# EAGLE design MinieasySens-RS485_V12-Build020 (EAGLE 7.7.0)
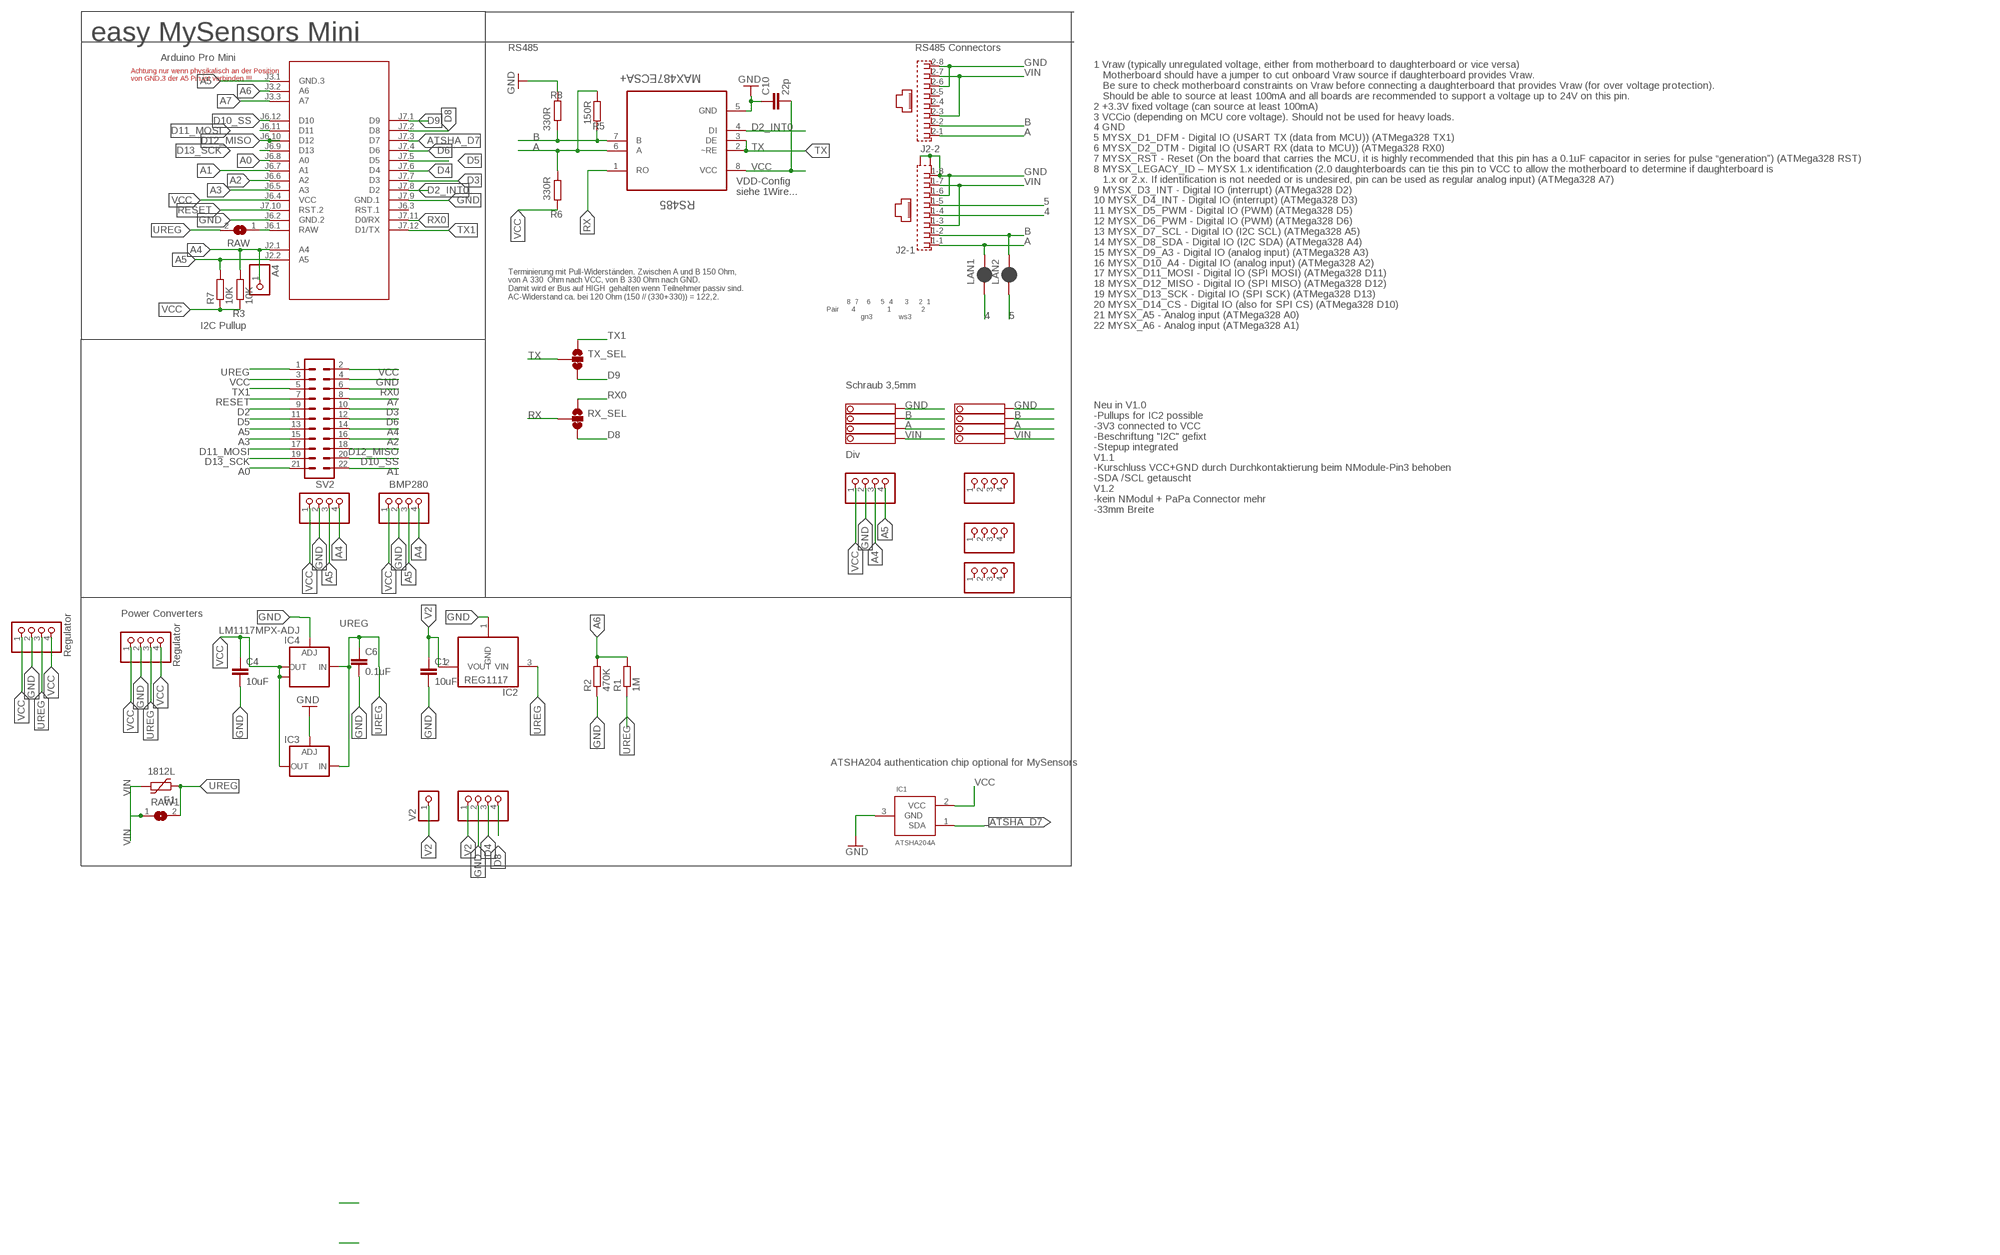
[diagram p0: schematic, sheet 1]

## Parts
A4  PINHD-1X1  [1X01]
BH1750  PINHD-1X04_2.54-S  [1X04-S]
C1  10uF  C-EUC1210  [C1210]
C4  10uF  C-EUC1210  [C1210]
C6  0.1uF  C-EUC1206  [C1206]
C10  22p  C-EUC0805  [C0805]
F1  1812L  [1812L]
I2C-1  PINHD-1X04_2.54-S  [1X04-S]
I2C-2  PINHD-1X04_2.54-S  [1X04-S]
IC1  ATSHA204A  [SOT23]
IC2  REG1117  [SOT223]
IC3  LD117ADT50TR  [DPACK]
IC4  LM1117MPX-ADJ  [SOT223]
J2  RJ45_2X_NARROW_SHILDPINS_NOCASE  [RJ45_2X_NARROW_SHILDPINS_NOCASE]
JP1  PINHD-1X04_2.54-S  [1X04-S]
JP2  PINHD-1X04_2.54-S  [1X04-S]
JP4  PINHD-1X04_2.54-S  [1X04-S]
LAN1  JUMPER-SMT_2_NC_PASTE_SILK  [SMT-JUMPER_2_NC_PASTE_SILK]
LAN2  JUMPER-SMT_2_NC_PASTE_SILK  [SMT-JUMPER_2_NC_PASTE_SILK]
M1  ARDUINO-PRO-MINI-3.3V#NP  [ARDUINO-PRO-MINI#NP]
R1  1M  R-EU_R0805  [R0805]
R2  470K  R-EU_R0805  [R0805]
R3  10K  R-EU_R0805  [R0805]
R5  150R  R-EU_R0805  [R0805]
R6  330R  R-EU_R0805  [R0805]
R7  10K  R-EU_R0805  [R0805]
R8  330R  R-EU_R0805  [R0805]
RAW  SJ  [SJ]
RAW1  SJ  [SJ]
RS485  MAX487ECSA+  [SOIC127P600X175-8N]
RX_SEL  JUMPER-SMT_3_1-NC_TRACE_SILK  [SMT-JUMPER_3_1-NC_TRACE_SILK]
STEPDWN  PINHD-1X04_2.54-S  [1X04-S]
STEPDWN1  PINHD-1X04_2.54-S  [1X04-S]
SV2  MA11-2  [MA11-2]
TX_SEL  JUMPER-SMT_3_1-NC_TRACE_SILK  [SMT-JUMPER_3_1-NC_TRACE_SILK]
V2  PINHD-1X1  [1X01]
V2-  PINHD-1X04_2.54-S  [1X04-S]
X1  1751264  [1751264]
X4  1751264  [1751264]

## Nets
4: J2.1-4 LAN1.1
5: J2.1-5 LAN2.1
A: J2.1-1 J2.2-1 LAN1.2 R5.1 R6.2 RS485.6(A) X1.2 X4.2
A0: M1.J6.8(A0) SV2.21
A1: M1.J6.7(A1) SV2.22
A2: M1.J6.6(A2) SV2.16
A3: M1.J6.5(A3) SV2.15
A4: A4.1 BH1750.4 I2C-1.4 I2C-2.3 M1.J2.1(A4) R3.2 SV2.14
A5: BH1750.3 I2C-1.3 I2C-2.4 M1.J2.2(A5) M1.J3.1(GND.3) R7.2 SV2.13
A6: M1.J3.2(A6) R1.2 R2.2
A7: M1.J3.3(A7) SV2.8
ATSHA_D7: IC1.1(SDA) M1.J7.3(D7)
B: J2.1-2 J2.2-2 LAN2.2 R5.2 R8.1 RS485.7(B) X1.3 X4.3
D2: SV2.9
D2_INT0: M1.J7.8(D2) RS485.4(DI)
D3: M1.J7.7(D3) SV2.10
D4: M1.J7.6(D4) V2-.3
D5: M1.J7.5(D5) SV2.11
D6: M1.J7.4(D6) SV2.12
D8: M1.J7.2(D8) RX_SEL.3 V2-.4
D9: M1.J7.1(D9) TX_SEL.3
D10_SS: M1.J6.12(D10) SV2.20
D11_MOSI: M1.J6.11(D11) SV2.17
D12_MISO: M1.J6.10(D12) SV2.18
D13_SCK: M1.J6.9(D13) SV2.19
GND [PWR]: BH1750.2 C1.2 C4.2 C6.2 C10.1 I2C-1.2 I2C-2.2 IC1.3(GND) IC2.1(GND) IC3.1(ADJ) IC4.1(ADJ) J2.1-6 J2.1-8 J2.2-6 J2.2-8 J2.G1(-1:S1) J2.G3(-1:S2) M1.J6.2(GND.2) M1.J7.9(GND.1) R2.1 R8.2 RS485.5(GND) STEPDWN1.2 STEPDWN.2 SV2.4 V2-.2 X1.4 X4.4
RAW [PWR]: M1.J6.1(RAW) RAW.1
RESET: M1.J7.10(RST.2) SV2.7
RX: RS485.1(RO) RX_SEL.2
RX0: M1.J7.11(D0/RX) RX_SEL.1 SV2.6
TX: RS485.2(~RE) RS485.3(DE) TX_SEL.2
TX1: M1.J7.12(D1/TX) SV2.5 TX_SEL.1
UREG [PWR]: C6.1 F1.P$1 IC2.3(VIN) IC3.3(IN) IC4.3(IN) R1.1 RAW1.2 RAW.2 STEPDWN1.3 STEPDWN.3 SV2.1
V2 [PWR]: C1.1 IC2.2(VOUT) V2-.1 V2.1
VCC [PWR]: BH1750.1 C4.1 C10.2 I2C-1.1 I2C-2.1 IC1.2(VCC) IC3.4(OUT) IC4.2(OUT) IC4.TAB(OUT1) M1.J6.4(VCC) R3.1 R6.1 R7.1 RS485.8(VCC) STEPDWN1.1 STEPDWN1.4 STEPDWN.1 STEPDWN.4 SV2.2 SV2.3
VIN [PWR]: F1.P$2 J2.1-3 J2.1-7 J2.2-3 J2.2-7 RAW1.1 X1.1 X4.1
Unconnected: J2.2-4 J2.2-5 JP1.1 JP1.2 JP1.3 JP1.4 JP2.1 JP2.2 JP2.3 JP2.4 JP4.1 JP4.2 JP4.3 JP4.4 M1.J6.3(RST.1)

## Notes on the sheet
- easy MySensors Mini
- RS485 | RS485 Connectors
- Arduino Pro Mini
- Achtung nur wenn physikalisch an der Position 
  von GND.3 der A5 Pin ist verbinden !!!
- VDD-Config
  siehe 1Wire...
- Terminierung mit Pull-Widerständen. Zwischen A und B 150 Ohm,
  von A 330  Ohm nach VCC, von B 330 Ohm nach GND. 
  Damit wird er Bus auf HIGH  gehalten wenn Teilnehmer passiv sind.
  AC-Widerstand ca. bei 120 Ohm (150 // (330+330)) = 122,2.
- 8  7    6     5  4      3     2  1
  Pair      4                1               2
                   gn3             ws3
- I2C Pullup
- 1 Vraw (typically unregulated voltage, either from motherboard to daughterboard or vice versa)
     Motherboard should have a jumper to cut onboard Vraw source if daughterboard provides Vraw. 
     Be sure to check motherboard constraints on Vraw before connecting a daughterboard that provides Vraw (for over voltage protection). 
     Should be able to source at least 100mA and all boards are recommended to support a voltage up to 24V on this pin.
  2 +3.3V fixed voltage (can source at least 100mA)
  3 VCCio (depending on MCU core voltage). Should not be used for heavy loads.
  4 GND
  5 MYSX_D1_DFM - Digital IO (USART TX (data from MCU)) (ATMega328 TX1)
  6 MYSX_D2_DTM - Digital IO (USART RX (data to MCU)) (ATMega328 RX0)
  7 MYSX_RST - Reset (On the board that carries the MCU, it is highly recommended that this pin has a 0.1uF capacitor in series for pulse “generation”) (ATMega328 RST)
  8 MYSX_LEGACY_ID – MYSX 1.x identification (2.0 daughterboards can tie this pin to VCC to allow the motherboard to determine if daughterboard is 
     1.x or 2.x. If identification is not needed or is undesired, pin can be used as regular analog input) (ATMega328 A7)
  9 MYSX_D3_INT - Digital IO (interrupt) (ATMega328 D2)
  10 MYSX_D4_INT - Digital IO (interrupt) (ATMega328 D3)
  11 MYSX_D5_PWM - Digital IO (PWM) (ATMega328 D5)
  12 MYSX_D6_PWM - Digital IO (PWM) (ATMega328 D6)
  13 MYSX_D7_SCL - Digital IO (I2C SCL) (ATMega328 A5)
  14 MYSX_D8_SDA - Digital IO (I2C SDA) (ATMega328 A4)
  15 MYSX_D9_A3 - Digital IO (analog input) (ATMega328 A3)
  16 MYSX_D10_A4 - Digital IO (analog input) (ATMega328 A2)
  17 MYSX_D11_MOSI - Digital IO (SPI MOSI) (ATMega328 D11)
  18 MYSX_D12_MISO - Digital IO (SPI MISO) (ATMega328 D12)
  19 MYSX_D13_SCK - Digital IO (SPI SCK) (ATMega328 D13)
  20 MYSX_D14_CS - Digital IO (also for SPI CS) (ATMega328 D10)
  21 MYSX_A5 - Analog input (ATMega328 A0)
  22 MYSX_A6 - Analog input (ATMega328 A1)
- Schraub 3,5mm
- Div
- BMP280
- Neu in V1.0
  -Pullups for IC2 possible
  -3V3 connected to VCC
  -Beschriftung "I2C" gefixt
  -Stepup integrated
  V1.1
  -Kurschluss VCC+GND durch Durchkontaktierung beim NModule-Pin3 behoben
  -SDA /SCL getauscht
  V1.2
  -kein NModul + PaPa Connector mehr
  -33mm Breite
- Power Converters
- Regulator
- Regulator
- ATSHA204 authentication chip optional for MySensors

## Library data of the parts
A4 V2 = pinhead:PINHD-1X1: PIN HEADER
BH1750 I2C-1 I2C-2 JP1 JP2 JP4 STEPDWN STEPDWN1 V2- = pinhead-2:PINHD-1X04: PIN HEADER
C1 C4 C6 C10 = rcl:C-EU: CAPACITOR, European symbol
F1 = ptc-littlefuse:1812L
IC1 = Sensor:ATSHA204A
IC2 = burr-brown:REG1117: 800mA and 1A Low Dropout (LDO) Positive Regulator 1.8V, 2.5V, 2.85V, 3.3V, 5V, and Adj; MPN: REG1117; OC_FARNELL: 1097566; OC_NEWARK: 14P6981
IC3 = v-reg:LD117A?*: Low drop fixed and adjustable positive voltage regulators 1 A Source: http://www.st.com/stonline/products/literature/ds/7194/ld1117axx.pdf
IC4 = lm1117:LM1117MPX-ADJ
J2 = RJ45:RJ45_2X_NARROW_SHILDPINS_NOCASE: RJ45 connector
LAN1 LAN2 = SparkFun-Jumpers:JUMPER-SMT_2_NC_PASTE: Normally closed solder jumper This jumper has an aperture in the stencil to allow solder paste to bridge the split in the wire so it's normally closed (NC). Wick off the solder to open the connection. Reapply solder to reclose the connection.
M1 = diy-modules:ARDUINO-PRO-MINI-*#NP: Arduino Pro Mini without programming pads
R1-R3 R5-R8 = rcl:R-EU_: RESISTOR, European symbol
RAW RAW1 = jumper:SJ: SMD solder JUMPER
RS485 = Maxim_By_element14_Batch_1:MAX487ECSA+: Low-Power, Slew-Rate-Limited RS-485/RS-422 Transceivers; MPN: MAX487ECSA+; OC_FARNELL: 9724532; OC_NEWARK: 68K4803; PACKAGE: SOIC-8; SUPPLIER: Maxim
RX_SEL TX_SEL = SparkFun-Jumpers:JUMPER-SMT_3_1-NC_TRACE: Normally closed trace jumper (1 of 2 connections) This jumper has a trace between two pads so it's normally closed (NC). The other connection is normally open (NO). Use a razor knife to open the connection. For best results follow the IPC guidelines for cutting traces: Cutout at least 0.063 mm (0.005 in). Remove all loose material to clean up the cut area. Seal the cut with an approved epoxy. Reapply solder to reclose the connection, or to close the NO connection.
SV2 = con-Pinheader:MA11-2: PIN HEADER; OC_FARNELL: unknown; OC_NEWARK: unknown
X1 X4 = con-phoenix-350:1751264: MKDS 1/ 4-3,5 Printklemme Nennstrom: 10 A Bemessungsspannung: 160 V Raster: 3,5 mm Polzahl: 4 Montageart: Löten Anschlussart: Schraubanschluss Anschlussrichtung vom Leiter zur Platine: 0° Source: http://eshop.phoenixcontact.com .. 1751264.pdf; MPN: 1751264; OC_FARNELL: unknown; OC_NEWARK: 10R0934

## Net classes
0 default: width 0.254 mm, clearance 0.205 mm
1 PWR: width 0.406 mm, clearance 0.205 mm to class 0, clearance 0.205 mm

## Board
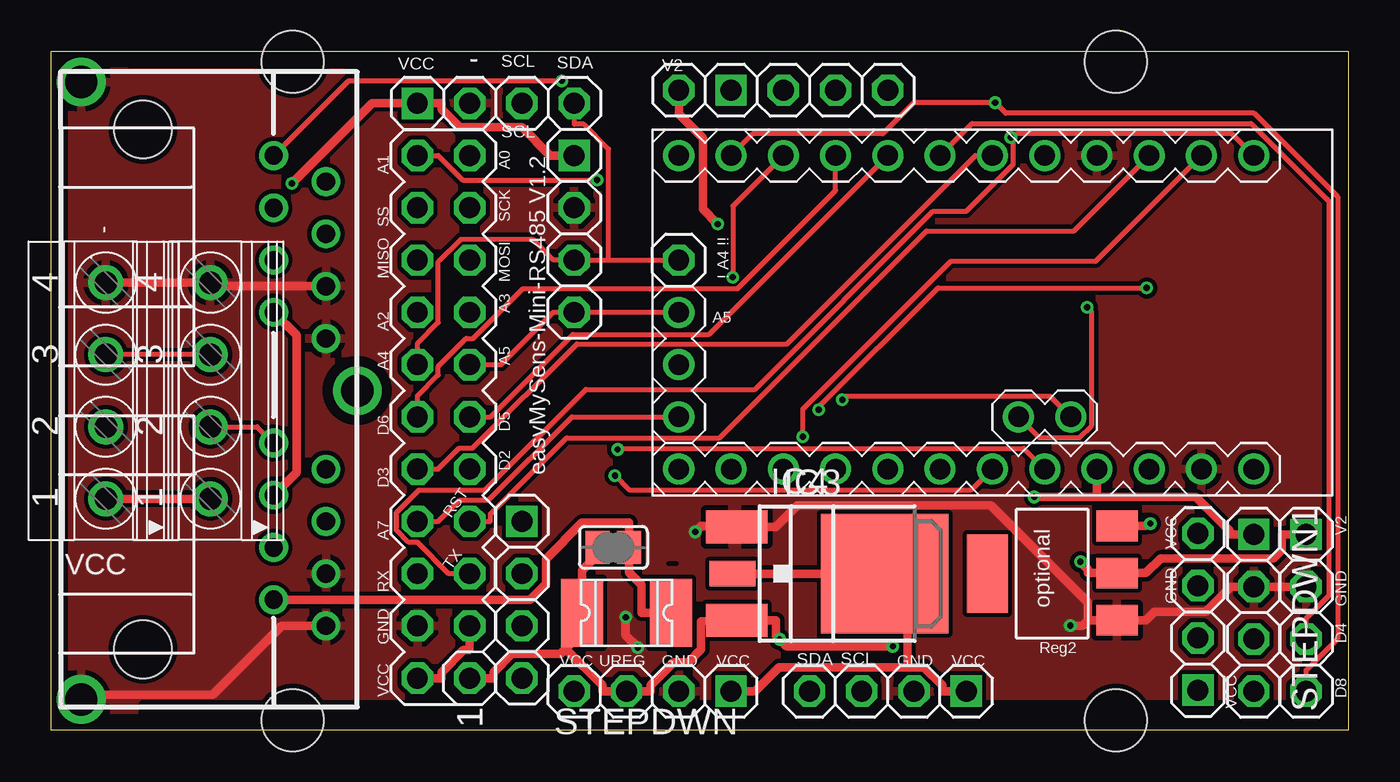
[diagram p1: board, top side]
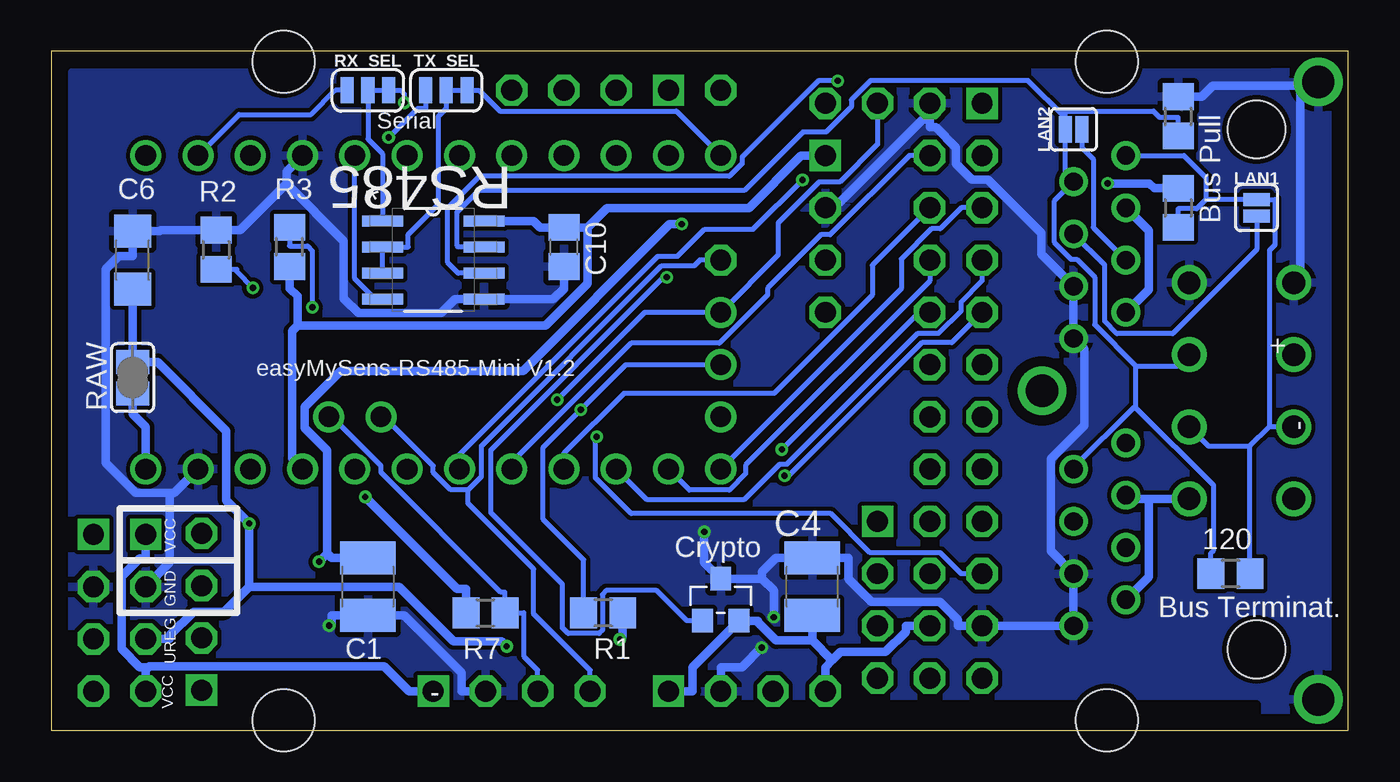
[diagram p2: board, bottom side, seen from below]

Size 63 x 33 mm. Coordinates in mm from the lower left corner, seen from the top.
Outline: 63,0 0,0 0,33 63,33 63,0
Copper layers (1*16): Top 0.035mm / dielectric 1.5mm / Bottom 0.035mm
Design rules "dirt_cheap_dirty_boards.v1": minimum track width 5mil, minimum drill 12mil, track to track 5mil, track to pad 5mil, pad to pad 5mil, via to via 5mil, smd to smd 0mil, copper to edge 10mil, drill to drill 10mil, minimum pad ring 10mil, minimum via ring 6mil, stop-mask expansion 2mil, vias tented up to drill 25mil, thermal gap 10mil
Holes 3 mm at 11.72,32.5 11.72,0.5 51.72,32.5 51.72,0.5
tRestrict: area 3.8,32.4 to 62.9,33; area 4.4,0 to 62.9,1.3; area 13.3,14.9 to 16.5,18.1; 2 lines
bRestrict: area 3.8,32.4 to 62.9,33; area 4.4,0 to 62.9,1.3; area 13.3,14.9 to 16.5,18.1; 2 lines

### Footprints (pad centres in the part's own frame; a part is rotated, then mirrored left to right if it is on the bottom)
1X01 = drill 1.016 octagon: 1 0,0
1X04-S = drill 1.016 square: 1 -3.81,0 | drill 1.016 octagon: 2 -1.27,0; 3 1.27,0; 4 3.81,0
C1210 = smd 1.6 x 2.7: 1 -1.4,0; 2 1.4,0
C1206 = smd 1.6 x 1.8: 1 -1.4,0; 2 1.4,0
C0805 = smd 1.3 x 1.5: 1 -0.95,0; 2 0.95,0
1812L = smd 2.03 x 3.3: P$1 -2.16,0; P$2 2.16,0
SOT23 = smd 1.016 x 1.143: 1 -0.889,-1.016; 2 0.889,-1.016; 3 0,1.016
SOT223 = smd 1.499 x 2.007: 1 -2.261,-3.15; 2 0.025,-3.15; 3 2.311,-3.15 | smd 3.81 x 2.007: 4 0,3.15
DPACK = smd 1.6 x 3: 1 -2.28,-4.8; 3 2.28,-4.8 | smd 5.8 x 6.2: 4 0,2.38
SOT223' = smd 1.219 x 2.235: 1 -2.311,-3.099; 2 0,-3.099; 3 2.311,-3.099 | smd 3.6 x 2.2: TAB 0,3.099
RJ45_2X_NARROW_SHILDPINS_NOCASE = drill 0.889: 1-1 -11.43,6.35; 1-2 -10.16,8.89; 1-3 -8.89,6.35; 1-4 -7.62,8.89; 1-5 -6.35,6.35; 1-6 -5.08,8.89; 1-7 -3.81,6.35; 1-8 -2.54,8.89; 2-1 2.54,6.35; 2-2 3.81,8.89; 2-3 5.08,6.35; 2-4 6.35,8.89; 2-5 7.62,6.35; 2-6 8.89,8.89; 2-7 10.16,6.35; 2-8 11.43,8.89 | drill 1.575 pad 2.184: G1 -15,-3; G2 0,10.414; G3 15,-3 | hole 2.8: -12.7,0; 12.573,0
SMT-JUMPER_2_NC_PASTE_SILK = smd 0.635 x 1.27: 1 -0.406,0; 2 0.406,0
ARDUINO-PRO-MINI#NP = drill 1: J2.1 -1.27,5.08; J2.2 -3.81,5.08; J3.1 15.24,0; J3.2 15.24,2.54; J3.3 15.24,5.08; J6.1 -12.7,7.62; J6.2 -10.16,7.62; J6.3 -7.62,7.62; J6.4 -5.08,7.62; J6.5 -2.54,7.62; J6.6 0,7.62; J6.7 2.54,7.62; J6.8 5.08,7.62; J6.9 7.62,7.62; J6.10 10.16,7.62; J6.11 12.7,7.62; J6.12 15.24,7.62; J7.1 15.24,-7.62; J7.2 12.7,-7.62; J7.3 10.16,-7.62; J7.4 7.62,-7.62; J7.5 5.08,-7.62; J7.6 2.54,-7.62; J7.7 0,-7.62; J7.8 -2.54,-7.62; J7.9 -5.08,-7.62; J7.10 -7.62,-7.62; J7.11 -10.16,-7.62; J7.12 -12.7,-7.62
R0805 = smd 1.3 x 1.5: 1 -0.95,0; 2 0.95,0
SJ = smd 1.168 x 1.6: 1 -0.762,0; 2 0.762,0
SOIC127P600X175-8N = smd 1.981 x 0.533: 1 -2.464,1.905; 2 -2.464,0.635; 3 -2.464,-0.635; 4 -2.464,-1.905; 5 2.464,-1.905; 6 2.464,-0.635; 7 2.464,0.635; 8 2.464,1.905
SMT-JUMPER_3_1-NC_TRACE_SILK = smd 0.635 x 1.27: 1 -1.016,0; 2 0,0; 3 1.016,0
MA11-2 = drill 1.016 octagon: 1 -12.7,-1.27; 2 -12.7,1.27; 3 -10.16,-1.27; 4 -10.16,1.27; 5 -7.62,-1.27; 6 -7.62,1.27; 7 -5.08,-1.27; 8 -5.08,1.27; 9 -2.54,-1.27; 10 -2.54,1.27; 11 0,-1.27; 12 0,1.27; 13 2.54,-1.27; 14 2.54,1.27; 15 5.08,-1.27; 16 5.08,1.27; 17 7.62,-1.27; 18 7.62,1.27; 19 10.16,-1.27; 20 10.16,1.27; 21 12.7,-1.27; 22 12.7,1.27
1751264 = drill 1.1 pad 1.7: 1 -5.25,-0.1; 2 -1.75,-0.1; 3 1.75,-0.1; 4 5.25,-0.1

### Placement (x,y rotation side)
A4  30.48,22.86 90 top
BH1750  21.59,30.48 0 top
C1  47.62,6.99 270 bottom
C4  26.04,6.99 90 bottom
C6  59.05,22.86 90 bottom
C10  38.1,23.5 90 bottom
F1  27.94,5.71 0 top
I2C-1  40.64,1.91 180 top
I2C-2  25.4,24.13 270 top
IC1  30.48,6.35 0 bottom
IC2  48.62,7.62 90 top
IC3  38.1,7.62 270 top
IC4  LM1117MPX-ADJ  [SOT223']  36.2,7.62 270 top
J2  4.45,16.51 270 top
JP1  22.86,6.35 270 top
JP2  36.83,31.11 0 top
JP4  55.7,5.76 90 top
LAN1  4.45,25.4 90 bottom
LAN2  13.34,29.21 180 bottom
M1  45.72,20.32 180 top
R1  36.2,5.71 180 bottom
R2  55,23.36 270 bottom
R3  51.44,23.5 90 bottom
R5  5.71,7.62 180 bottom
R6  8.26,25.4 270 bottom
R7  41.91,5.71 0 bottom
R8  8.26,29.84 90 bottom
RAW  59.05,17.14 90 bottom
RAW1  27.3,8.89 180 top
RS485  44.45,22.86 0 bottom
RX_SEL  47.62,31.11 0 bottom
STEPDWN  29.21,1.91 180 top
STEPDWN1  58.42,5.71 270 top
SV2  19.05,15.24 90 top
TX_SEL  43.81,31.11 0 bottom
V2  30.48,31.11 0 top
V2-  60.96,5.71 270 top
X1  2.54,16.51 90 top
X4  7.62,16.51 90 top

### Tracks (layer width: path | path; a pad name or v marks a point on that pad's centre or on a via)
4
  Bottom 0.254: LAN1.1 4.45,23.36 8.52,19.29 11.22,19.29 11.83,19.89 11.83,22.62 J2.1-4
5
  Bottom 0.254: LAN2.1 12.93,28.32 12.38,27.77 12.38,24.45 J2.1-5
A  (via drill 0.3 pad 0.61)
  Top 0.254: J2.1-1 14.43,31.57 v24.8,31.57 | X4.2 10.01,14.76 J2.2-1
  Bottom 0.254: RS485.6 43.23,22.23 43.77,22.76 43.77,25.36 42.2,26.93 | v24.8,31.57 25.74,31.57 29.45,27.87 29.45,27.54 30.06,26.93 42.2,26.93 | 42.2,26.93 | 3.83,14.76 3.83,23.33 3.56,23.59 3.56,25.81 LAN1.2 6.9,25.81 | 6.9,25.81 7.35,25.35 8.26,25.35 R6.2 | J2.1-1 7.97,27.94 6.9,26.87 6.9,25.81 | R5.1 4.76,13.82 | X4.2 6.79,13.82 4.76,13.82 | X1.2 3.83,14.76 | 3.83,14.76 4.76,13.82
A0
  Bottom 0.254: M1.J6.8 40.64,13.02 34.83,18.83 30.54,18.83 28.21,21.16 28.21,21.49 25.61,24.09 25.16,24.09 21.34,27.92 21.34,27.94 SV2.21
A1  (via drill 0.3 pad 0.61)
  Top 0.254: SV2.22 18.8,27.94 19.98,26.75 v26.51,26.75
  Bottom 0.254: M1.J6.7 43.18,13.41 33.54,23.05 32.57,23.05 31.26,24.36 28.91,24.36 v26.51,26.75
A2  (via drill 0.3 pad 0.61)
  Top 0.254: v27.38,12.38 28.07,11.69 44.71,11.69 M1.J6.6
  Bottom 0.254: SV2.16 19.25,18.84 20.7,18.84 27.17,12.38 v27.38,12.38
A3  (via drill 0.3 pad 0.61)
  Top 0.254: v27.51,13.66 27.56,13.71 47.25,13.71 M1.J6.5
  Bottom 0.254: SV2.15 20.84,20.32 v27.51,13.66
A4  (via drill 0.3 pad 0.61)
  Top 0.254: M1.J2.1 48,14.23 49.95,14.23 50.54,14.82 50.54,20.34 v50.32,20.56 | 27.07,22.86 A4.1 | 27.07,22.86 I2C-2.3 24.38,22.86 23.37,23.88 19.89,23.88 18.8,22.78 18.8,19.81 17.78,18.8 SV2.14 | 27.07,22.86 27.07,28.26 25.87,29.46 25.4,29.46 BH1750.4
  Bottom 0.254: 42.76,11.69 42.11,12.34 42.11,13.83 33.35,22.59 31.77,22.59 31.5,22.86 A4.1 | v50.32,20.56 50.32,23.31 50.56,23.54 51.44,23.54 R3.2 | 42.76,11.69 42.76,11.04 39.57,7.85 39.57,5.66 36.83,2.92 I2C-1.4 | 42.76,11.69 43.6,11.69 44.45,12.54 44.45,12.86 46.83,15.24 M1.J2.1
A5  (via drill 0.3 pad 0.61)
  Top 0.254: v38.43,16.07 38.61,16.25 48.52,16.25 M1.J2.2 | SV2.13 21.84,17.78 24.38,20.32 I2C-2.4 M1.J3.1
  Bottom 0.254: I2C-1.3 39.37,2.92 40.06,3.61 40.06,5.71 R7.2 40.96,6.72 41.17,6.72 46.99,12.54 46.99,12.86 49.37,15.24 M1.J2.2 | v38.43,16.07 34.18,20.32 M1.J3.1 27.69,23.11 27.69,24.66 25.7,26.65 24.69,26.65 22.86,28.48 BH1750.3
A6  (via drill 0.3 pad 0.61)
  Top 0.254: v37.27,15.59 | v37.27,15.59 37.27,15.71 43.08,21.51 v53.21,21.51
  Bottom 0.254: M1.J3.2 35.09,17.78 v37.27,15.59 39.11,13.75 39.11,10.26 37.15,8.29 R1.2 | R2.2 54,22.41 54,22.29 v53.21,21.51
A7
  Top 0.254: M1.J3.3 25.28,15.24 21.24,11.2 19.84,11.2 18.8,10.16 SV2.8
ATSHA_D7  (via drill 0.3 pad 0.61)
  Top 0.254: M1.J7.3 33.1,25.48 v33.1,22.03
  Bottom 0.254: v33.1,22.03 33.26,22.03 41.65,13.64 41.65,10.58 38.17,7.1 38.17,4.98 37.9,4.71 36.39,4.71 36.23,4.86 36.23,6.61 36.04,6.8 33.59,6.8 32.13,5.33 IC1.1
B
  Top 0.254: X4.3 X1.3
  Bottom 0.254: 13.74,29.77 15.55,31.58 23.2,31.58 24.13,30.65 24.13,30.31 25.36,29.09 26.49,29.09 29.33,26.24 42.23,26.24 43.31,25.17 43.31,23.57 43.23,23.5 RS485.7 | 13.74,29.77 13.74,30.1 9.46,30.1 9.16,29.8 8.26,29.8 R8.1 | 13.74,29.77 LAN2.2 13.74,27.08 J2.1-2 14.29,25.71 14.29,23.73 13.46,22.9 13.18,22.9 12.3,22.02 12.3,19.72 10.3,17.72 | R5.2 6.67,8.62 6.53,8.76 6.53,11.91 10.3,15.68 | 10.3,15.68 10.3,17.72 | 10.3,15.68 10.44,15.68 13.34,12.78 J2.2-2 | 10.3,17.72 8.26,17.72 X4.3
D2_INT0
  Bottom 0.254: RS485.4 47.26,20.95 48.26,21.95 M1.J7.8
D3
  Top 0.254: M1.J7.7 44.89,27.94 35.74,18.79 25.53,18.79 20.46,13.72 19.81,13.72 18.8,12.7 SV2.10
D4
  Top 0.254: M1.J7.6 44.73,29.49 58.3,29.49 62.06,25.73 62.06,6.54 60.98,5.46 60.96,5.46 V2-.3
D5
  Top 0.254: SV2.11 21.34,15.24 25.34,19.25 31.95,19.25 M1.J7.5
D6
  Top 0.254: M1.J7.4 38.1,26.24 33.34,21.47 22.91,21.47 20.49,19.05 20.15,19.05 18.8,17.69 18.8,17.27 17.78,16.26 SV2.12
D8  (via drill 0.3 pad 0.61)
  Top 0.254: V2-.4 60.96,2.92 62.52,4.48 62.52,25.92 58.44,30 46.37,30 v45.85,30.51 41.91,30.51 40.39,28.99 34.07,28.99 M1.J7.2
  Bottom 0.254: v45.85,30.51 45.85,30.93 46.04,31.11 RX_SEL.3
D9
  Bottom 0.254: TX_SEL.3 42.23,31.11 41.21,30.1 32.64,30.1 M1.J7.1
D10_SS
  Bottom 0.254: SV2.20 18.8,25.4 19.81,24.38 20.24,24.38 21.71,22.91 21.71,21.47 M1.J6.12
D11_MOSI
  Bottom 0.254: SV2.17 20.32,21.84 29.27,12.9 29.27,12.48 30.06,11.69 32.01,11.69 M1.J6.11
D12_MISO
  Bottom 0.254: M1.J6.10 34.09,11.23 29.32,11.23 27.61,12.94 27.26,12.94 20.89,19.3 19.9,19.3 18.8,20.41 18.8,20.83 17.78,21.84 SV2.18
D13_SCK
  Bottom 0.254: SV2.19 23.11,22.61 23.11,21.17 27.89,16.39 35.19,16.39 38.1,13.48 M1.J6.9
GND  (via drill 0.3 pad 0.61)
  Top 0.406: X1.4 X4.4 7.89,21.59 J2.1-6 | 50.36,5.36 50.1,5.09 v49.51,5.09 | 50.36,5.36 50.36,6.22 45.65,10.93 36.24,10.93 35.21,9.9 IC3.1 33.27,9.93 IC4.1 31.57,9.93 v31.29,9.65 | 50.36,5.36 IC2.1 53.19,5.36 53.59,5.76 56.09,5.76 57.25,6.92 57.25,6.99 STEPDWN1.2 59.79,6.99 V2-.2 | J2.2-8 11.18,5.08 7.83,1.73 1.67,1.73 J2.G3 | v27.9,5.5 27.9,4.62 v28.49,4.03
  Bottom 0.406: v49.51,5.09 49.38,5.22 49.38,5.58 C1.2 45.87,5.58 43.08,2.8 43.08,1.91 I2C-1.2 | 20.32,29.69 20.32,29.31 20.03,29.31 19.05,28.33 19.05,27.55 18.27,26.77 17.49,26.77 14.9,24.18 14.9,23.16 J2.1-6 J2.1-8 12.82,18.53 12.82,14.82 14.44,13.19 14.44,8.73 J2.2-6 J2.2-8 16.61,5.08 SV2.4 18.95,5.08 18.95,5.37 19.83,6.25 23.15,6.25 24.28,7.38 24.28,8.38 C4.2 27.79,8.38 28.47,7.71 28.47,7.37 | BH1750.2 20.32,29.69 | I2C-2.2 24.97,25.4 20.68,29.69 20.32,29.69 | v27.9,5.5 27.9,6.8 28.47,7.37 | 28.47,7.37 29.56,7.37 IC1.3 31.29,8.17 v31.29,9.65 | 51.58,26.57 51.58,27.16 M1.J7.9 | 51.58,26.57 48.8,23.79 48.8,21 48.08,20.28 44.06,20.28 43.38,20.95 RS485.5 38.63,20.95 38.1,21.49 C10.1 | 51.58,26.57 53.84,24.32 R2.1 57.69,24.32 57.75,24.26 C6.2 59.05,23.05 59.74,23.05 60.37,22.43 60.37,13 58.9,11.53 57.25,11.53 | STEPDWN.2 30.48,3.08 29.45,3.08 v28.49,4.03 | R8.2 7.1,30.8 6.57,31.33 2.33,31.33 | STEPDWN1.2 57.25,8.15 57.25,11.53 | 57.25,11.53 57.05,11.53 M1.J6.2 | J2.G1 2.15,31.51 2.33,31.33 | 2.33,31.33 2.33,22.07 X1.4
  pour Top: 1,1 1,32 62,32 62,1
  pour Bottom: 1,1 1,32 62,32 62,1
RAW
  Bottom 0.406: RAW.1 59.05,15.39 58.42,14.76 M1.J6.1
RESET
  Top 0.254: SV2.7 21.34,10.16 21.34,10.52 25.03,14.22 32.47,14.22 42.52,24.28 49.68,24.28 M1.J7.10
RX
  Bottom 0.254: RX_SEL.2 47.62,28.74 46.91,28.03 RS485.1
RX0  (via drill 0.3 pad 0.61)
  Top 0.254: v36.51,14.27 36.51,15.62 43.7,22.8 50.74,22.8 M1.J7.11
  Bottom 0.254: SV2.6 18.8,7.62 19.81,8.64 23.22,8.64 25.13,10.55 34.83,10.55 36.57,12.28 36.57,14.22 v36.51,14.27 | RX_SEL.1 49.21,31.11 50.39,29.94 53.88,29.94 M1.J7.11
TX
  Bottom 0.254: TX_SEL.2 43.81,30.23 44.19,29.85 44.19,25.59 45.67,24.11 45.67,23.5 RS485.2 RS485.3
TX1  (via drill 0.3 pad 0.61)
  Top 0.254: 46.73,28.82 46.94,29.03 57.33,29.03 M1.J7.12 | 46.73,28.82 46.73,27.52 44.44,25.24 42.84,25.24 34.18,16.58 25.97,16.58 21.08,11.68 17.86,11.68 16.76,10.58 16.76,9.74 17.36,9.14 17.78,9.14 19.3,7.62 SV2.5 | 46.73,28.82 v46.62,28.82
  Bottom 0.254: v46.62,28.82 45.21,30.23 44.83,30.23 TX_SEL.1
UREG  (via drill 0.3 pad 0.61)
  Top 0.406: 24.99,3.97 25.78,4.76 F1.P$1 25.78,7.77 26.54,8.54 RAW1.2 | 24.99,3.97 24.73,3.71 22.37,3.71 21.49,2.83 21.49,2.54 SV2.1 | 24.99,3.97 26.77,2.19 26.77,1.91 STEPDWN.3 29.11,1.91 29.11,2.19 30.23,3.31 30.95,3.31 31.57,3.93 31.57,5.31 IC4.3 33.27,5.31 IC3.3 35.21,5.34 35.21,4.59 v35.38,4.42 35.72,4.08 v40.88,4.08 | IC2.3 53.19,9.93 53.31,10.06 v53.39,10.06
  Bottom 0.406: v35.38,4.42 35.24,4.56 R1.1 | v40.88,4.08 41.13,4.34 | 41.13,4.34 | 41.13,4.34 43.46,4.34 46.1,6.98 53.39,6.98 | 53.39,6.98 v53.39,10.06 54.5,11.17 54.5,14.56 57.85,17.91 RAW.2 C6.1 | 53.39,6.98 54.6,5.76 56.1,5.76 57.25,4.61 57.25,4.45 STEPDWN1.3
V2  (via drill 0.3 pad 0.61)
  Top 0.406: V2-.1 59.79,9.53 59.79,8.78 59.36,8.36 53.9,8.36 53.19,7.64 IC2.2 50.36,7.64 50.36,7.84 v50,8.2 | V2.1 30.48,29.95 31.65,28.77 31.65,25.34 v32.37,24.61
  Bottom 0.406: 49.6,8.6 49.6,13.6 50.69,14.69 50.69,15.72 48.94,17.48 40.09,17.48 32.96,24.61 v32.37,24.61 | v50,8.2 49.6,8.6 | 49.6,8.6 49.38,8.38 C1.1 | 49.6,8.6
VCC  (via drill 0.3 pad 0.61)
  Top 0.406: IC4.2 34.62,7.62 | IC4.TAB 34.62,7.62 | 34.62,7.62 | IC4.TAB | IC4.TAB | 41.59,3.08 42.4,3.08 43.28,2.2 43.28,1.91 I2C-1.1 | 41.59,3.08 35.36,3.08 34.19,1.91 STEPDWN.1 | 41.59,3.08 41.59,6.5 IC3.4 | IC3.4 | IC4.TAB IC3.4 | 50.8,11.35 v47.76,11.35 | 50.8,11.35 55.59,11.35 57.25,9.69 57.25,9.53 STEPDWN1.1 | 50.8,11.35 M1.J6.4 | I2C-2.1 24.23,27.94 22.86,29.31 19.83,29.31 18.95,30.19 18.95,30.48 BH1750.1 15.58,30.48 v11.68,26.58 | SV2.2 18.95,2.54 18.95,2.83 20.03,3.91 20.32,3.91 SV2.3
  Bottom 0.406: R7.1 42.86,6.87 43.28,6.87 v47.76,11.35 | 36.94,24.45 35.99,25.39 29.12,25.39 26.57,27.94 I2C-2.1 | 51.05,19.67 38.99,19.67 36.94,21.72 36.94,24.45 | 51.05,19.67 51.31,19.41 51.31,13.21 M1.J6.4 | 51.05,19.67 51.05,21.1 51.44,21.49 R3.1 | 36.94,24.45 C10.2 39.26,24.45 39.58,24.77 40.59,24.77 RS485.8 | v11.68,26.58 9.64,26.58 9.41,26.35 R6.1 | I2C-1.1 45.62,1.91 46.84,3.13 58.24,3.13 58.42,2.95 | 58.42,2.95 58.42,3.08 58.71,3.08 59.59,3.95 59.59,7.48 58.71,8.36 58.42,8.36 STEPDWN1.1 | STEPDWN1.4 58.42,2.95 | STEPDWN.1 31.85,1.91 31.85,3.08 IC1.2 28.68,5.33 28.68,5.26 27.79,4.38 26.04,4.38 | 25.07,3.41 26.04,4.38 | SV2.3 21.49,5.08 21.49,4.79 22.47,3.81 24.66,3.81 25.07,3.41 | 25.07,3.41 25.4,3.08 STEPDWN.4 | C4.1 26.04,4.38
VIN
  Top 0.406: J2.2-3 11.9,12.54 11.9,19.21 J2.1-7 | F1.P$2 28.68,5.71 28.68,7.07 28.07,7.68 RAW1.1 28.07,9.35 28.07,10.1 25.78,10.1 24.03,8.35 24.03,7.13 23.25,6.35 J2.2-7 | X4.1 X1.1
  Bottom 0.406: J2.1-7 9.69,21.43 9.69,24.29 J2.1-3 | 9.69,11.26 9.69,7.46 J2.2-7 | X4.1 9.69,11.26 | 9.69,11.26 10.62,11.26 J2.2-3

### Text on the board
tPlace: A0 | A1 | SCK | SS | MOSI | MISO | ! A4 !! | A3 | A5 | A2 | A5 | A4 | D5 | D6 | D2 | D3 | easyMySens-Mini-RS485 V1.2 | RST | optional | VCC | V2 | A7 | TX | GND | GND | RX | D4 | GND | VCC | UREG | GND | VCC | GND | VCC | Reg2 | VCC | D8 | VCC
bPlace: easyMySens-RS485-Mini V1.2 | VCC | GND | UREG | VCC
tNames: VCC | - | SCL | SDA | V2 | SCL | - | VCC | SCL | SDA
bNames: Bus Pull | Serial | R3 | R2 | C6 | C10 | + | RAW | - | 120 | Crypto | Bus Terminat. | R1 | R7 | C1 | -
tValues: Gehäuse: RND 455‑00307